# EAGLE schematic hp1 (EAGLE 9.6.2)
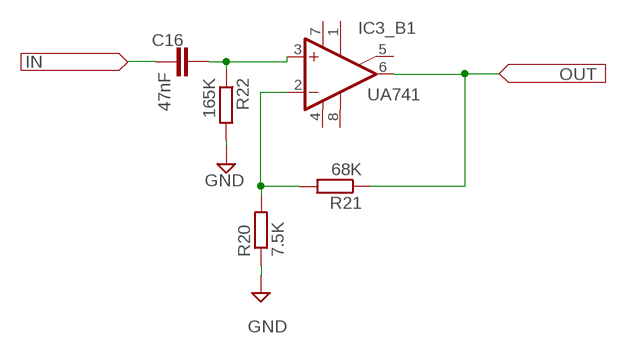
[diagram p0: schematic, sheet 1]
SUPPLY1 (V-->): IN: IN

## Parts
C16  47nF  C-EU025-025X050  [C025-025X050]
IC3_B1  LF356N  [DIL08]
R20  7.5K  R-EU_0207/10  [0207/10]
R21  68K  R-EU_0207/10  [0207/10]
R22  165K  R-EU_0207/10  [0207/10]

## Nets
GND: R20.1 R22.2
N$41: IC3_B1.6(OUT) R21.1
N$42: R20.2 R21.2
N$43: C16.2
N$44: C16.1 R22.1
N$45: IC3_B1.3(+IN)
N$46: IC3_B1.2(-IN)
Unconnected: IC3_B1.1(ON1) IC3_B1.5(ON2) IC3_B1.8(OPT)

## Power pins joined to a net without a drawn wire
V+: IC3_B1.7(V+)
V-: IC3_B1.4(V-)

## Library data of the parts
C16 = rcl:C-EU: CAPACITOR, European symbol; SPICEPREFIX: C
IC3_B1 = linear:LF356: OP AMP; UA741: UA741
R20-R22 = rcl:R-EU_: RESISTOR, European symbol; SPICEPREFIX: R